# Altium schematic sheet Structure - Flow Chart.SchDoc
size 381 x 381 mm
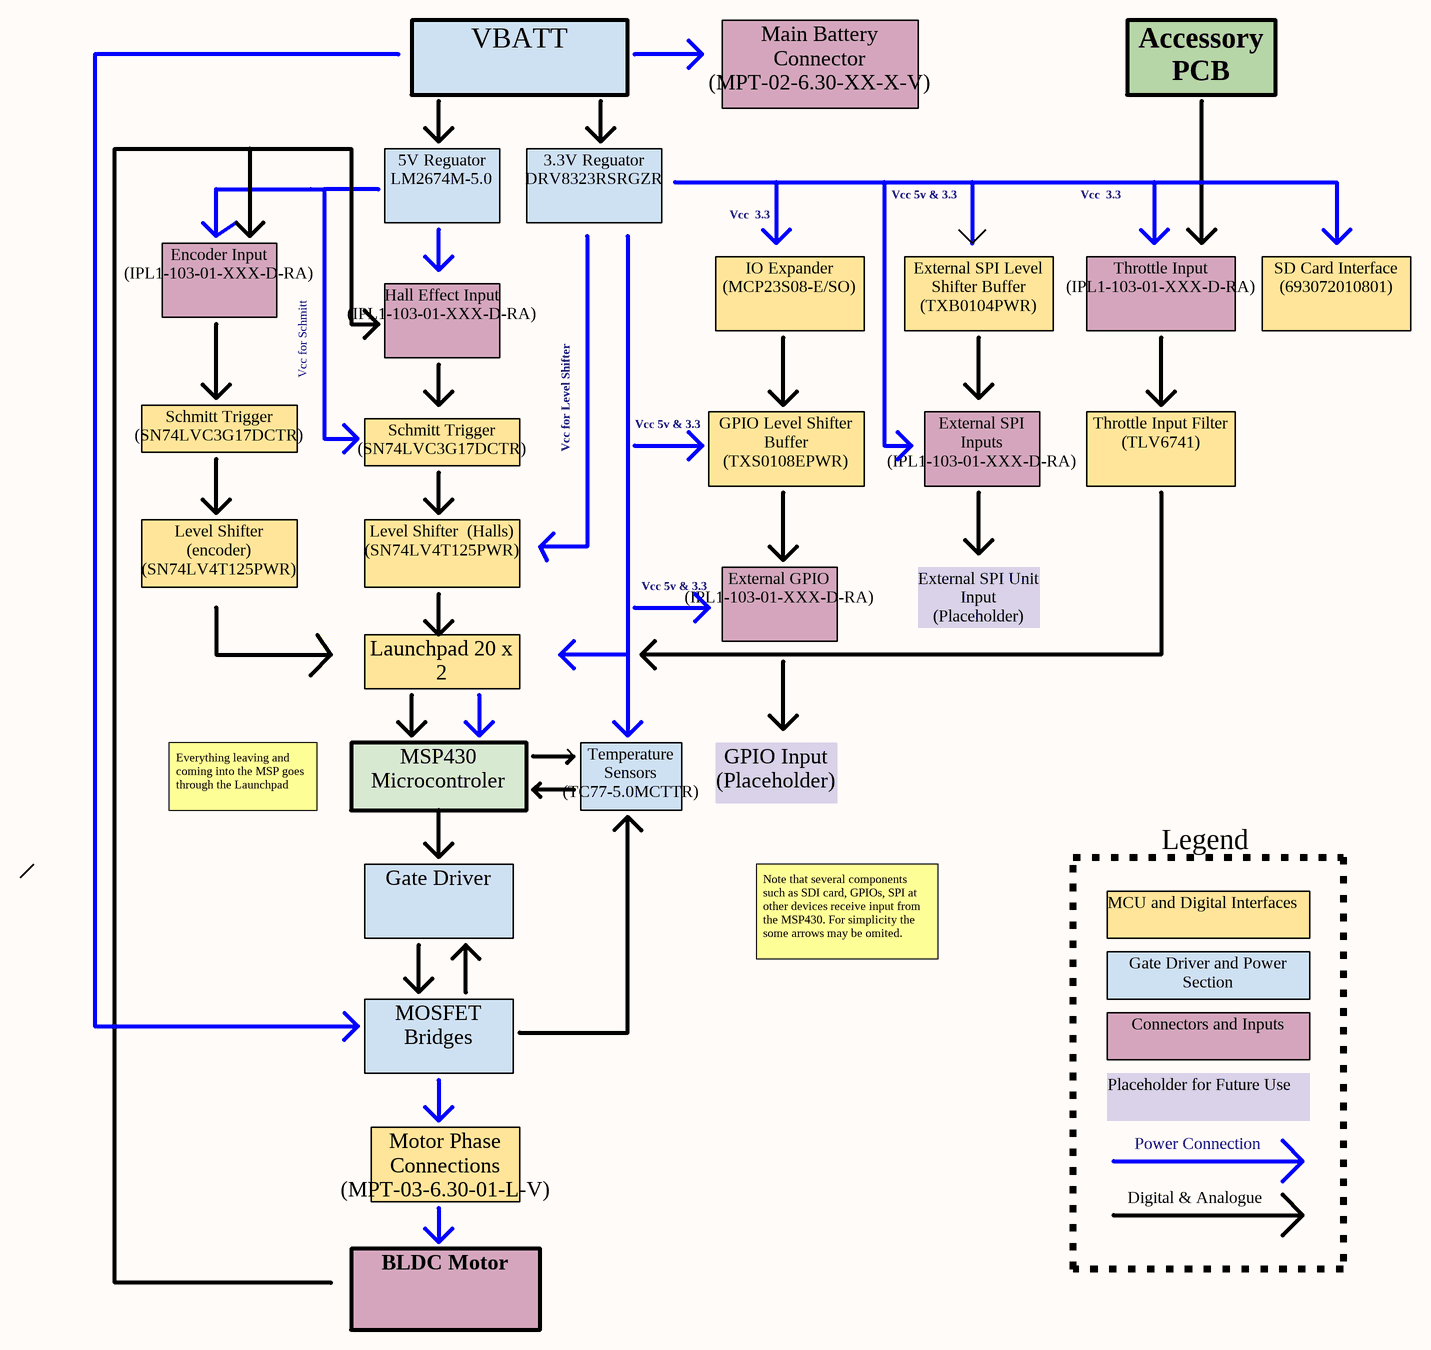
[diagram p0: Structure - Flow Chart.SchDoc]

## Notes on the sheet
- VBATT
- Main Battery Connector (MPT-02-6.30-XX-X-V)
- Accessory PCB
- 5V Reguator
  LM2674M-5.0
- 3.3V Reguator
  DRV8323RSRGZR
- Vcc  3.3
- Vcc 5v & 3.3
- Encoder Input   (IPL1-103-01-XXX-D-RA)
- Hall Effect Input  (IPL1-103-01-XXX-D-RA)
- IO Expander           (MCP23S08-E/SO)
- External SPI Level Shifter Buffer    (TXB0104PWR)
- Throttle Input   (IPL1-103-01-XXX-D-RA)
- SD Card Interface  (693072010801)
- Vcc for Schmitt
- Schmitt Trigger (SN74LVC3G17DCTR)
- Vcc for Level Shifter
- GPIO Level Shifter Buffer     (TXS0108EPWR)
- External SPI Inputs   (IPL1-103-01-XXX-D-RA)
- Throttle Input Filter    (TLV6741)
- Level Shifter  (encoder)   (SN74LV4T125PWR)
- Level Shifter  (Halls)  (SN74LV4T125PWR)
- External SPI Unit Input (Placeholder)
- Launchpad 20 x 2
- External GPIO   (IPL1-103-01-XXX-D-RA)
- Everything leaving and coming into the MSP goes through the Launchpad
- MSP430 Microcontroler
- Temperature Sensors (TC77-5.0MCTTR)
- GPIO Input (Placeholder)
- Legend
- Gate Driver
- Note that several components such as SDI card, GPIOs, SPI at other devices receive input from the MSP430. For simplicity the some arrows may be omited.
- MCU and Digital Interfaces
- Gate Driver and Power Section
- MOSFET Bridges
- Connectors and Inputs
- Placeholder for Future Use
- Power Connection
- Motor Phase Connections   (MPT-03-6.30-01-L-V)
- Digital & Analogue
- BLDC Motor